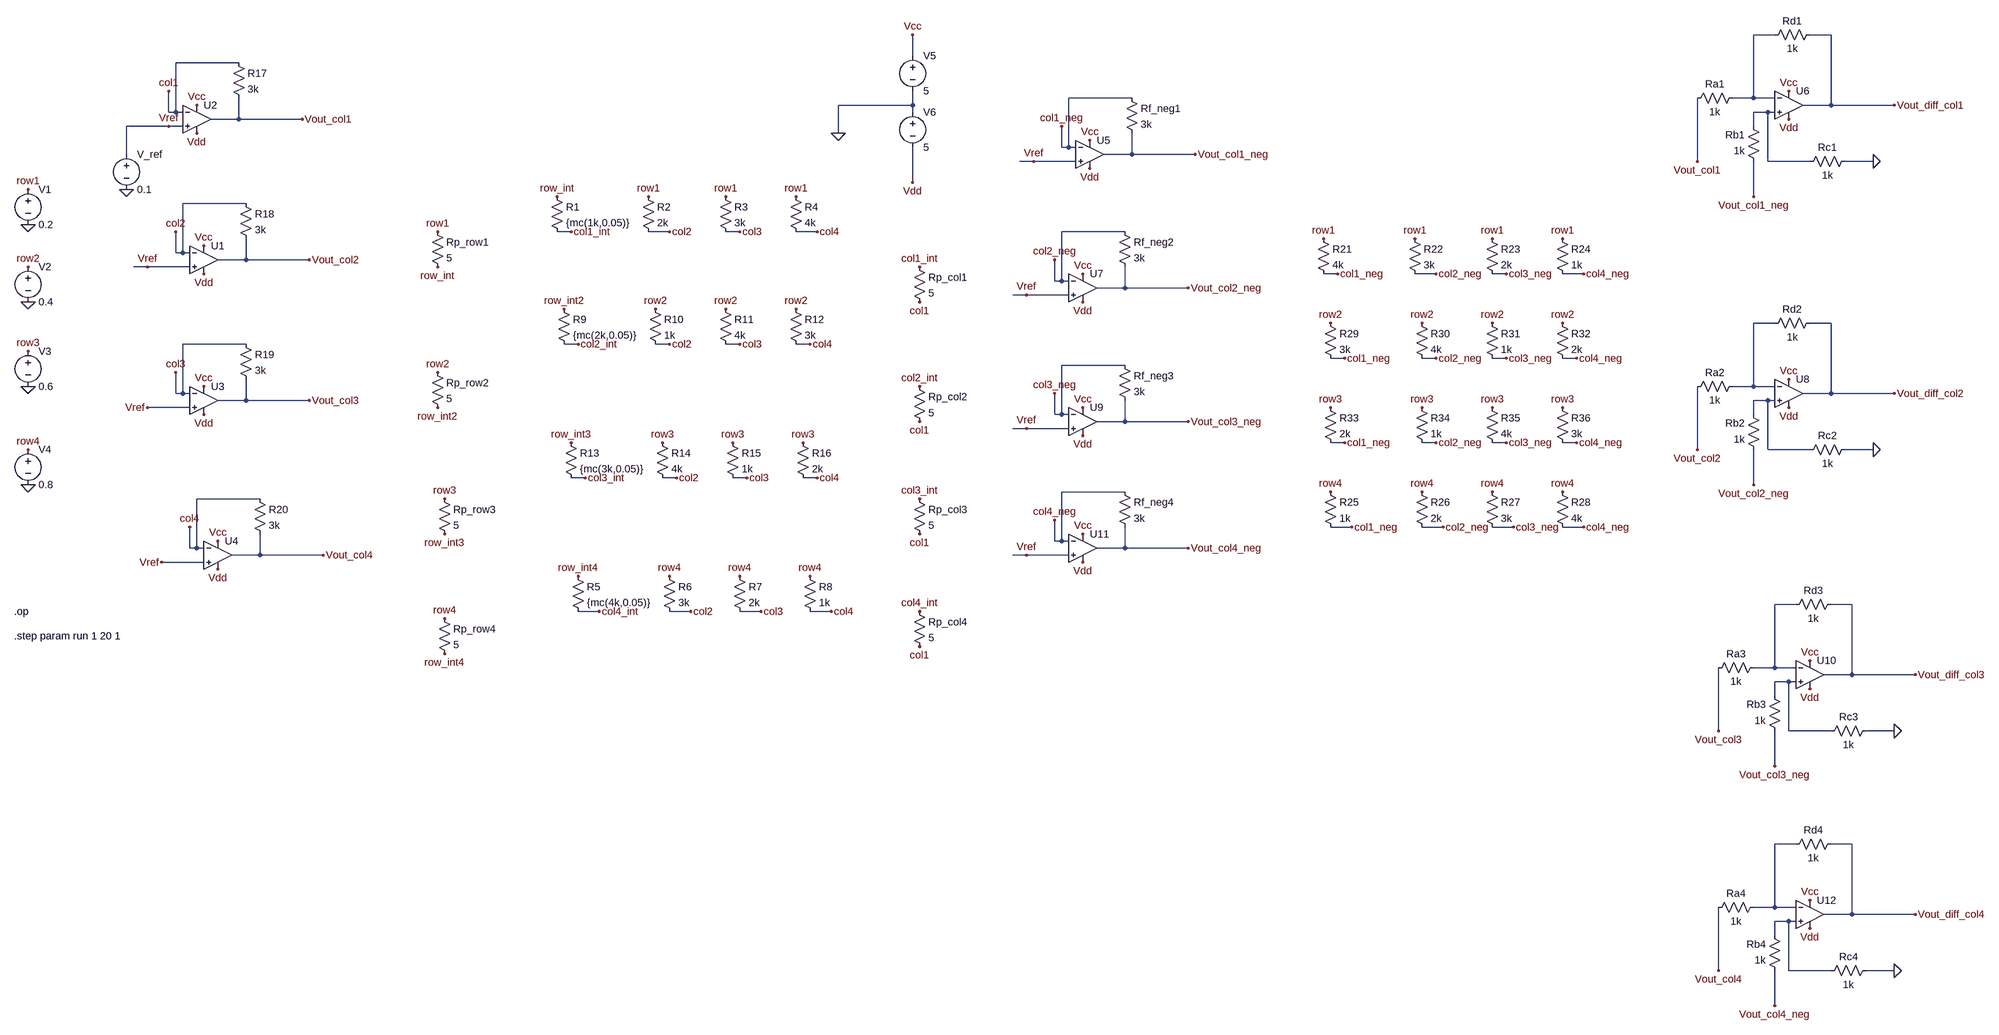
[diagram p0: schematic crossbar_positve array.asc]
crossbar_positve array.asc, the LTspice schematic file:
Version 4.1
SHEET 1 3436 2300
WIRE 2880 -608 2832 -608
WIRE 3008 -608 2960 -608
WIRE 464 -560 464 -608
WIRE -1568 -544 -1712 -544
WIRE 1040 -464 896 -464
WIRE 2832 -464 2832 -608
WIRE 2832 -464 2784 -464
WIRE 2880 -464 2832 -464
WIRE 464 -448 464 -480
WIRE 464 -448 288 -448
WIRE 3008 -448 3008 -608
WIRE 3008 -448 2944 -448
WIRE 3152 -448 3008 -448
WIRE -1728 -432 -1728 -480
WIRE -1712 -432 -1712 -544
WIRE -1712 -432 -1728 -432
WIRE -1696 -432 -1712 -432
WIRE 464 -432 464 -448
WIRE 2864 -432 2832 -432
WIRE 2880 -432 2864 -432
WIRE -1568 -416 -1568 -464
WIRE -1568 -416 -1632 -416
WIRE -1424 -416 -1568 -416
WIRE -1728 -400 -1824 -400
WIRE -1696 -400 -1728 -400
WIRE 2832 -400 2832 -432
WIRE 288 -384 288 -448
WIRE 880 -352 880 -400
WIRE 896 -352 896 -464
WIRE 896 -352 880 -352
WIRE 912 -352 896 -352
WIRE -1824 -336 -1824 -400
WIRE 1040 -336 1040 -384
WIRE 1040 -336 976 -336
WIRE 1184 -336 1040 -336
WIRE 816 -320 784 -320
WIRE 912 -320 816 -320
WIRE 2704 -320 2704 -464
WIRE 2864 -320 2864 -432
WIRE 2960 -320 2864 -320
WIRE 3104 -320 3040 -320
WIRE 464 -272 464 -352
WIRE 2832 -240 2832 -320
WIRE -1552 -224 -1696 -224
WIRE -320 -160 -352 -160
WIRE -96 -160 -144 -160
WIRE 64 -160 32 -160
WIRE 240 -160 192 -160
WIRE 1024 -160 880 -160
WIRE -1712 -112 -1712 -160
WIRE -1696 -112 -1696 -224
WIRE -1696 -112 -1712 -112
WIRE -1680 -112 -1696 -112
WIRE -1552 -96 -1552 -144
WIRE -1552 -96 -1616 -96
WIRE -1408 -96 -1552 -96
WIRE -1776 -80 -1808 -80
WIRE -1680 -80 -1776 -80
WIRE 1680 -64 1648 -64
WIRE 1904 -64 1856 -64
WIRE 2064 -64 2032 -64
WIRE 2240 -64 2192 -64
WIRE 864 -48 864 -96
WIRE 880 -48 880 -160
WIRE 880 -48 864 -48
WIRE 896 -48 880 -48
WIRE 1024 -32 1024 -80
WIRE 1024 -32 960 -32
WIRE 1168 -32 1024 -32
WIRE 800 -16 768 -16
WIRE 896 -16 800 -16
WIRE 2880 48 2832 48
WIRE 3008 48 2960 48
WIRE -1552 96 -1696 96
WIRE -304 96 -336 96
WIRE -96 96 -128 96
WIRE 64 96 32 96
WIRE 224 96 192 96
WIRE 1696 128 1664 128
WIRE 1904 128 1872 128
WIRE 2064 128 2032 128
WIRE 2224 128 2192 128
WIRE 1024 144 880 144
WIRE 2832 192 2832 48
WIRE 2832 192 2784 192
WIRE 2880 192 2832 192
WIRE -1712 208 -1712 160
WIRE -1696 208 -1696 96
WIRE -1696 208 -1712 208
WIRE -1680 208 -1696 208
WIRE 3008 208 3008 48
WIRE 3008 208 2944 208
WIRE 3152 208 3008 208
WIRE -1552 224 -1552 176
WIRE -1552 224 -1616 224
WIRE -1408 224 -1552 224
WIRE 2864 224 2832 224
WIRE 2880 224 2864 224
WIRE -1680 240 -1776 240
WIRE 864 256 864 208
WIRE 880 256 880 144
WIRE 880 256 864 256
WIRE 896 256 880 256
WIRE 2832 256 2832 224
WIRE 1024 272 1024 224
WIRE 1024 272 960 272
WIRE 1168 272 1024 272
WIRE 800 288 768 288
WIRE 896 288 800 288
WIRE 1696 320 1664 320
WIRE 1904 320 1872 320
WIRE 2064 320 2032 320
WIRE 2224 320 2192 320
WIRE 2704 336 2704 192
WIRE 2864 336 2864 224
WIRE 2960 336 2864 336
WIRE 3104 336 3040 336
WIRE -288 400 -320 400
WIRE -80 400 -112 400
WIRE 80 400 48 400
WIRE 240 400 208 400
WIRE 2832 416 2832 336
WIRE 1024 432 880 432
WIRE -1520 448 -1664 448
WIRE 1712 512 1664 512
WIRE 1920 512 1872 512
WIRE 2080 512 2032 512
WIRE 2240 512 2192 512
WIRE 864 544 864 496
WIRE 880 544 880 432
WIRE 880 544 864 544
WIRE 896 544 880 544
WIRE -1680 560 -1680 512
WIRE -1664 560 -1664 448
WIRE -1664 560 -1680 560
WIRE -1648 560 -1664 560
WIRE 1024 560 1024 512
WIRE 1024 560 960 560
WIRE 1168 560 1024 560
WIRE -1520 576 -1520 528
WIRE -1520 576 -1584 576
WIRE -1376 576 -1520 576
WIRE 800 576 768 576
WIRE 896 576 800 576
WIRE -1648 592 -1744 592
WIRE 2928 688 2880 688
WIRE 3056 688 3008 688
WIRE -256 704 -304 704
WIRE -48 704 -96 704
WIRE 112 704 64 704
WIRE 272 704 224 704
WIRE 2880 832 2880 688
WIRE 2880 832 2832 832
WIRE 2928 832 2880 832
WIRE 3056 848 3056 688
WIRE 3056 848 2992 848
WIRE 3200 848 3056 848
WIRE 2912 864 2880 864
WIRE 2928 864 2912 864
WIRE 2880 896 2880 864
WIRE 2752 976 2752 832
WIRE 2912 976 2912 864
WIRE 3008 976 2912 976
WIRE 3152 976 3088 976
WIRE 2880 1056 2880 976
WIRE 2928 1360 2880 1360
WIRE 3056 1360 3008 1360
WIRE 2880 1504 2880 1360
WIRE 2880 1504 2832 1504
WIRE 2928 1504 2880 1504
WIRE 3056 1520 3056 1360
WIRE 3056 1520 2992 1520
WIRE 3200 1520 3056 1520
WIRE 2912 1536 2880 1536
WIRE 2928 1536 2912 1536
WIRE 2880 1568 2880 1536
WIRE 2752 1648 2752 1504
WIRE 2912 1648 2912 1536
WIRE 3008 1648 2912 1648
WIRE 3152 1648 3088 1648
WIRE 2880 1728 2880 1648
FLAG -352 -240 row_int
FLAG -144 -240 row1
FLAG 32 -240 row1
FLAG 192 -240 row1
FLAG -336 16 row_int2
FLAG -128 16 row2
FLAG 32 16 row2
FLAG 192 16 row2
FLAG -320 320 row_int3
FLAG -112 320 row3
FLAG 48 320 row3
FLAG 208 320 row3
FLAG -304 624 row_int4
FLAG -96 624 row4
FLAG 64 624 row4
FLAG 224 624 row4
FLAG -96 -160 col2
FLAG -96 96 col2
FLAG -80 400 col2
FLAG -48 704 col2
FLAG 64 -160 col3
FLAG 64 96 col3
FLAG 80 400 col3
FLAG 112 704 col3
FLAG 240 -160 col4
FLAG 224 96 col4
FLAG 240 400 col4
FLAG 272 704 col4
FLAG -2048 192 0
FLAG -2048 416 0
FLAG -2048 0 0
FLAG -2048 -176 0
FLAG -2048 -256 row1
FLAG -2048 -80 row2
FLAG -2048 112 row3
FLAG -2048 336 row4
FLAG -1824 -256 0
FLAG -1728 -480 col1
FLAG -1664 -448 Vcc
FLAG 464 -608 Vcc
FLAG -1664 -384 Vdd
FLAG 464 -272 Vdd
FLAG 288 -384 0
FLAG -1424 -416 Vout_col1
FLAG -1712 -160 col2
FLAG -1648 -128 Vcc
FLAG -1648 -64 Vdd
FLAG -1408 -96 Vout_col2
FLAG -1712 160 col3
FLAG -1648 192 Vcc
FLAG -1648 256 Vdd
FLAG -1408 224 Vout_col3
FLAG -1680 512 col4
FLAG -1616 544 Vcc
FLAG -1616 608 Vdd
FLAG -1376 576 Vout_col4
FLAG -1776 -80 Vref
FLAG -1776 240 Vref
FLAG -1744 592 Vref
FLAG -1728 -400 Vref
FLAG 1648 -144 row1
FLAG 1856 -144 row1
FLAG 2032 -144 row1
FLAG 2192 -144 row1
FLAG 1664 48 row2
FLAG 1872 48 row2
FLAG 2032 48 row2
FLAG 2192 48 row2
FLAG 1664 240 row3
FLAG 1872 240 row3
FLAG 2032 240 row3
FLAG 2192 240 row3
FLAG 1664 432 row4
FLAG 1872 432 row4
FLAG 2032 432 row4
FLAG 2192 432 row4
FLAG 1712 512 col1_neg
FLAG 1680 -64 col1_neg
FLAG 1696 128 col1_neg
FLAG 1696 320 col1_neg
FLAG 1904 -64 col2_neg
FLAG 1904 128 col2_neg
FLAG 1904 320 col2_neg
FLAG 1920 512 col2_neg
FLAG 2064 -64 col3_neg
FLAG 2064 128 col3_neg
FLAG 2064 320 col3_neg
FLAG 2080 512 col3_neg
FLAG 2240 -64 col4_neg
FLAG 2224 128 col4_neg
FLAG 2224 320 col4_neg
FLAG 2240 512 col4_neg
FLAG 880 -400 col1_neg
FLAG 944 -368 Vcc
FLAG 944 -304 Vdd
FLAG 1184 -336 Vout_col1_neg
FLAG 816 -320 Vref
FLAG 2912 -480 Vcc
FLAG 2912 -416 Vdd
FLAG 3152 -448 Vout_diff_col1
FLAG 2704 -320 Vout_col1
FLAG 2832 -240 Vout_col1_neg
FLAG 3104 -320 0
FLAG 864 -96 col2_neg
FLAG 928 -64 Vcc
FLAG 928 0 Vdd
FLAG 1168 -32 Vout_col2_neg
FLAG 800 -16 Vref
FLAG 2912 176 Vcc
FLAG 2912 240 Vdd
FLAG 3152 208 Vout_diff_col2
FLAG 2704 336 Vout_col2
FLAG 2832 416 Vout_col2_neg
FLAG 3104 336 0
FLAG 864 208 col3_neg
FLAG 928 240 Vcc
FLAG 928 304 Vdd
FLAG 1168 272 Vout_col3_neg
FLAG 800 288 Vref
FLAG 2960 816 Vcc
FLAG 2960 880 Vdd
FLAG 3200 848 Vout_diff_col3
FLAG 2752 976 Vout_col3
FLAG 2880 1056 Vout_col3_neg
FLAG 3152 976 0
FLAG 864 496 col4_neg
FLAG 928 528 Vcc
FLAG 928 592 Vdd
FLAG 1168 560 Vout_col4_neg
FLAG 800 576 Vref
FLAG 2960 1488 Vcc
FLAG 2960 1552 Vdd
FLAG 3200 1520 Vout_diff_col4
FLAG 2752 1648 Vout_col4
FLAG 2880 1728 Vout_col4_neg
FLAG 3152 1648 0
FLAG -784 -160 row1
FLAG -784 -80 row_int
FLAG -784 160 row2
FLAG -784 240 row_int2
FLAG -768 448 row3
FLAG -768 528 row_int3
FLAG -768 720 row4
FLAG -768 800 row_int4
FLAG 480 -80 col1_int
FLAG 480 0 col1
FLAG -320 -160 col1_int
FLAG -304 96 col2_int
FLAG -288 400 col3_int
FLAG -256 704 col4_int
FLAG 480 192 col2_int
FLAG 480 272 col1
FLAG 480 448 col3_int
FLAG 480 528 col1
FLAG 480 704 col4_int
FLAG 480 784 col1
SYMBOL res -368 -256 R0
SYMATTR InstName R1
SYMATTR Value {mc(1k,0.05)}
SYMBOL res -160 -256 R0
SYMATTR InstName R2
SYMATTR Value 2k
SYMBOL res 16 -256 R0
SYMATTR InstName R3
SYMATTR Value 3k
SYMBOL res 176 -256 R0
SYMATTR InstName R4
SYMATTR Value 4k
SYMBOL res -320 608 R0
SYMATTR InstName R5
SYMATTR Value {mc(4k,0.05)}
SYMBOL res -112 608 R0
SYMATTR InstName R6
SYMATTR Value 3k
SYMBOL res 48 608 R0
SYMATTR InstName R7
SYMATTR Value 2k
SYMBOL res 208 608 R0
SYMATTR InstName R8
SYMATTR Value 1k
SYMBOL res -352 0 R0
SYMATTR InstName R9
SYMATTR Value {mc(2k,0.05)}
SYMBOL res -144 0 R0
SYMATTR InstName R10
SYMATTR Value 1k
SYMBOL res 16 0 R0
SYMATTR InstName R11
SYMATTR Value 4k
SYMBOL res 176 0 R0
SYMATTR InstName R12
SYMATTR Value 3k
SYMBOL res -336 304 R0
SYMATTR InstName R13
SYMATTR Value {mc(3k,0.05)}
SYMBOL res -128 304 R0
SYMATTR InstName R14
SYMATTR Value 4k
SYMBOL res 32 304 R0
SYMATTR InstName R15
SYMATTR Value 1k
SYMBOL res 192 304 R0
SYMATTR InstName R16
SYMATTR Value 2k
SYMBOL voltage -2048 -272 R0
SYMATTR InstName V1
SYMATTR Value 0.2
SYMBOL voltage -2048 -96 R0
SYMATTR InstName V2
SYMATTR Value 0.4
SYMBOL voltage -2048 96 R0
SYMATTR InstName V3
SYMATTR Value 0.6
SYMBOL voltage -2048 320 R0
SYMATTR InstName V4
SYMATTR Value 0.8
SYMBOL voltage -1824 -352 R0
SYMATTR InstName V_ref
SYMATTR Value 0.1
SYMBOL res -1584 -560 R0
SYMATTR InstName R17
SYMATTR Value 3k
SYMBOL voltage 464 -576 R0
WINDOW 123 0 0 Left 0
WINDOW 39 0 0 Left 0
SYMATTR InstName V5
SYMATTR Value 5
SYMBOL voltage 464 -448 R0
SYMATTR InstName V6
SYMATTR Value 5
SYMBOL OpAmps\\UniversalOpAmp2 -1664 -416 R0
SYMATTR InstName U2
SYMBOL res -1568 -240 R0
SYMATTR InstName R18
SYMATTR Value 3k
SYMBOL OpAmps\\UniversalOpAmp2 -1648 -96 R0
SYMATTR InstName U1
SYMBOL res -1568 80 R0
SYMATTR InstName R19
SYMATTR Value 3k
SYMBOL OpAmps\\UniversalOpAmp2 -1648 224 R0
SYMATTR InstName U3
SYMBOL res -1536 432 R0
SYMATTR InstName R20
SYMATTR Value 3k
SYMBOL OpAmps\\UniversalOpAmp2 -1616 576 R0
SYMATTR InstName U4
SYMBOL res 1632 -160 R0
SYMATTR InstName R21
SYMATTR Value 4k
SYMBOL res 1840 -160 R0
SYMATTR InstName R22
SYMATTR Value 3k
SYMBOL res 2016 -160 R0
SYMATTR InstName R23
SYMATTR Value 2k
SYMBOL res 2176 -160 R0
SYMATTR InstName R24
SYMATTR Value 1k
SYMBOL res 1648 416 R0
SYMATTR InstName R25
SYMATTR Value 1k
SYMBOL res 1856 416 R0
SYMATTR InstName R26
SYMATTR Value 2k
SYMBOL res 2016 416 R0
SYMATTR InstName R27
SYMATTR Value 3k
SYMBOL res 2176 416 R0
SYMATTR InstName R28
SYMATTR Value 4k
SYMBOL res 1648 32 R0
SYMATTR InstName R29
SYMATTR Value 3k
SYMBOL res 1856 32 R0
SYMATTR InstName R30
SYMATTR Value 4k
SYMBOL res 2016 32 R0
SYMATTR InstName R31
SYMATTR Value 1k
SYMBOL res 2176 32 R0
SYMATTR InstName R32
SYMATTR Value 2k
SYMBOL res 1648 224 R0
SYMATTR InstName R33
SYMATTR Value 2k
SYMBOL res 1856 224 R0
SYMATTR InstName R34
SYMATTR Value 1k
SYMBOL res 2016 224 R0
SYMATTR InstName R35
SYMATTR Value 4k
SYMBOL res 2176 224 R0
SYMATTR InstName R36
SYMATTR Value 3k
SYMBOL res 1024 -480 R0
SYMATTR InstName Rf_neg1
SYMATTR Value 3k
SYMBOL OpAmps\\UniversalOpAmp2 944 -336 R0
SYMATTR InstName U5
SYMBOL OpAmps\\UniversalOpAmp2 2912 -448 R0
SYMATTR InstName U6
SYMBOL res 2800 -480 R90
WINDOW 0 0 56 VBottom 2
WINDOW 3 32 56 VTop 2
SYMATTR InstName Ra1
SYMATTR Value 1k
SYMBOL res 2976 -624 R90
WINDOW 0 0 56 VBottom 2
WINDOW 3 32 56 VTop 2
SYMATTR InstName Rd1
SYMATTR Value 1k
SYMBOL res 2848 -304 R180
WINDOW 0 36 76 Left 2
WINDOW 3 36 40 Left 2
SYMATTR InstName Rb1
SYMATTR Value 1k
SYMBOL res 2944 -304 R270
WINDOW 0 32 56 VTop 2
WINDOW 3 0 56 VBottom 2
SYMATTR InstName Rc1
SYMATTR Value 1k
SYMBOL res 1008 -176 R0
SYMATTR InstName Rf_neg2
SYMATTR Value 3k
SYMBOL OpAmps\\UniversalOpAmp2 928 -32 R0
SYMATTR InstName U7
SYMBOL OpAmps\\UniversalOpAmp2 2912 208 R0
SYMATTR InstName U8
SYMBOL res 2800 176 R90
WINDOW 0 0 56 VBottom 2
WINDOW 3 32 56 VTop 2
SYMATTR InstName Ra2
SYMATTR Value 1k
SYMBOL res 2976 32 R90
WINDOW 0 0 56 VBottom 2
WINDOW 3 32 56 VTop 2
SYMATTR InstName Rd2
SYMATTR Value 1k
SYMBOL res 2848 352 R180
WINDOW 0 36 76 Left 2
WINDOW 3 36 40 Left 2
SYMATTR InstName Rb2
SYMATTR Value 1k
SYMBOL res 2944 352 R270
WINDOW 0 32 56 VTop 2
WINDOW 3 0 56 VBottom 2
SYMATTR InstName Rc2
SYMATTR Value 1k
SYMBOL res 1008 128 R0
SYMATTR InstName Rf_neg3
SYMATTR Value 3k
SYMBOL OpAmps\\UniversalOpAmp2 928 272 R0
SYMATTR InstName U9
SYMBOL OpAmps\\UniversalOpAmp2 2960 848 R0
SYMATTR InstName U10
SYMBOL res 2848 816 R90
WINDOW 0 0 56 VBottom 2
WINDOW 3 32 56 VTop 2
SYMATTR InstName Ra3
SYMATTR Value 1k
SYMBOL res 3024 672 R90
WINDOW 0 0 56 VBottom 2
WINDOW 3 32 56 VTop 2
SYMATTR InstName Rd3
SYMATTR Value 1k
SYMBOL res 2896 992 R180
WINDOW 0 36 76 Left 2
WINDOW 3 36 40 Left 2
SYMATTR InstName Rb3
SYMATTR Value 1k
SYMBOL res 2992 992 R270
WINDOW 0 32 56 VTop 2
WINDOW 3 0 56 VBottom 2
SYMATTR InstName Rc3
SYMATTR Value 1k
SYMBOL res 1008 416 R0
SYMATTR InstName Rf_neg4
SYMATTR Value 3k
SYMBOL OpAmps\\UniversalOpAmp2 928 560 R0
SYMATTR InstName U11
SYMBOL OpAmps\\UniversalOpAmp2 2960 1520 R0
SYMATTR InstName U12
SYMBOL res 2848 1488 R90
WINDOW 0 0 56 VBottom 2
WINDOW 3 32 56 VTop 2
SYMATTR InstName Ra4
SYMATTR Value 1k
SYMBOL res 3024 1344 R90
WINDOW 0 0 56 VBottom 2
WINDOW 3 32 56 VTop 2
SYMATTR InstName Rd4
SYMATTR Value 1k
SYMBOL res 2896 1664 R180
WINDOW 0 36 76 Left 2
WINDOW 3 36 40 Left 2
SYMATTR InstName Rb4
SYMATTR Value 1k
SYMBOL res 2992 1664 R270
WINDOW 0 32 56 VTop 2
WINDOW 3 0 56 VBottom 2
SYMATTR InstName Rc4
SYMATTR Value 1k
SYMBOL res -800 -176 R0
SYMATTR InstName Rp_row1
SYMATTR Value 5
SYMBOL res -800 144 R0
SYMATTR InstName Rp_row2
SYMATTR Value 5
SYMBOL res -784 432 R0
SYMATTR InstName Rp_row3
SYMATTR Value 5
SYMBOL res -784 704 R0
SYMATTR InstName Rp_row4
SYMATTR Value 5
SYMBOL res 464 -96 R0
SYMATTR InstName Rp_col1
SYMATTR Value 5
SYMBOL res 464 176 R0
SYMATTR InstName Rp_col2
SYMATTR Value 5
SYMBOL res 464 432 R0
SYMATTR InstName Rp_col3
SYMATTR Value 5
SYMBOL res 464 688 R0
SYMATTR InstName Rp_col4
SYMATTR Value 5
TEXT -2080 704 Left 2 !.op
TEXT -2080 760 Left 2 !.step param run 1 20 1

The netlist it stands for:
* crossbar_positve array.asc
R1 row_int col1_int {mc(1k,0.05)}
R2 row1 col2 2k
R3 row1 col3 3k
R4 row1 col4 4k
R5 row_int4 col4_int {mc(4k,0.05)}
R6 row4 col2 3k
R7 row4 col3 2k
R8 row4 col4 1k
R9 row_int2 col2_int {mc(2k,0.05)}
R10 row2 col2 1k
R11 row2 col3 4k
R12 row2 col4 3k
R13 row_int3 col3_int {mc(3k,0.05)}
R14 row3 col2 4k
R15 row3 col3 1k
R16 row3 col4 2k
V1 row1 0 0.2
V2 row2 0 0.4
V3 row3 0 0.6
V4 row4 0 0.8
V_ref Vref 0 0.1
R17 col1 Vout_col1 3k
V5 Vcc 0 5
V6 0 Vdd 5
X§U2 Vref col1 Vcc Vdd Vout_col1 level2 Avol=1Meg GBW=10Meg Slew=10Meg Ilimit=25m Rail=0 Vos=0 En=0 Enk=0 In=0 Ink=0 Rin=500Meg  ; pins In+ In- V+ V- OUT
R18 col2 Vout_col2 3k
X§U1 Vref col2 Vcc Vdd Vout_col2 level2 Avol=1Meg GBW=10Meg Slew=10Meg Ilimit=25m Rail=0 Vos=0 En=0 Enk=0 In=0 Ink=0 Rin=500Meg  ; pins In+ In- V+ V- OUT
R19 col3 Vout_col3 3k
X§U3 Vref col3 Vcc Vdd Vout_col3 level2 Avol=1Meg GBW=10Meg Slew=10Meg Ilimit=25m Rail=0 Vos=0 En=0 Enk=0 In=0 Ink=0 Rin=500Meg  ; pins In+ In- V+ V- OUT
R20 col4 Vout_col4 3k
X§U4 Vref col4 Vcc Vdd Vout_col4 level2 Avol=1Meg GBW=10Meg Slew=10Meg Ilimit=25m Rail=0 Vos=0 En=0 Enk=0 In=0 Ink=0 Rin=500Meg  ; pins In+ In- V+ V- OUT
R21 row1 col1_neg 4k
R22 row1 col2_neg 3k
R23 row1 col3_neg 2k
R24 row1 col4_neg 1k
R25 row4 col1_neg 1k
R26 row4 col2_neg 2k
R27 row4 col3_neg 3k
R28 row4 col4_neg 4k
R29 row2 col1_neg 3k
R30 row2 col2_neg 4k
R31 row2 col3_neg 1k
R32 row2 col4_neg 2k
R33 row3 col1_neg 2k
R34 row3 col2_neg 1k
R35 row3 col3_neg 4k
R36 row3 col4_neg 3k
Rf_neg1 col1_neg Vout_col1_neg 3k
X§U5 Vref col1_neg Vcc Vdd Vout_col1_neg level2 Avol=1Meg GBW=10Meg Slew=10Meg Ilimit=25m Rail=0 Vos=0 En=0 Enk=0 In=0 Ink=0 Rin=500Meg  ; pins In+ In- V+ V- OUT
X§U6 N002 N001 Vcc Vdd Vout_diff_col1 level2 Avol=1Meg GBW=10Meg Slew=10Meg Ilimit=25m Rail=0 Vos=0 En=0 Enk=0 In=0 Ink=0 Rin=500Meg  ; pins In+ In- V+ V- OUT
Ra1 N001 Vout_col1 1k
Rd1 Vout_diff_col1 N001 1k
Rb1 Vout_col1_neg N002 1k
Rc1 N002 0 1k
Rf_neg2 col2_neg Vout_col2_neg 3k
X§U7 Vref col2_neg Vcc Vdd Vout_col2_neg level2 Avol=1Meg GBW=10Meg Slew=10Meg Ilimit=25m Rail=0 Vos=0 En=0 Enk=0 In=0 Ink=0 Rin=500Meg  ; pins In+ In- V+ V- OUT
X§U8 N004 N003 Vcc Vdd Vout_diff_col2 level2 Avol=1Meg GBW=10Meg Slew=10Meg Ilimit=25m Rail=0 Vos=0 En=0 Enk=0 In=0 Ink=0 Rin=500Meg  ; pins In+ In- V+ V- OUT
Ra2 N003 Vout_col2 1k
Rd2 Vout_diff_col2 N003 1k
Rb2 Vout_col2_neg N004 1k
Rc2 N004 0 1k
Rf_neg3 col3_neg Vout_col3_neg 3k
X§U9 Vref col3_neg Vcc Vdd Vout_col3_neg level2 Avol=1Meg GBW=10Meg Slew=10Meg Ilimit=25m Rail=0 Vos=0 En=0 Enk=0 In=0 Ink=0 Rin=500Meg  ; pins In+ In- V+ V- OUT
X§U10 N006 N005 Vcc Vdd Vout_diff_col3 level2 Avol=1Meg GBW=10Meg Slew=10Meg Ilimit=25m Rail=0 Vos=0 En=0 Enk=0 In=0 Ink=0 Rin=500Meg  ; pins In+ In- V+ V- OUT
Ra3 N005 Vout_col3 1k
Rd3 Vout_diff_col3 N005 1k
Rb3 Vout_col3_neg N006 1k
Rc3 N006 0 1k
Rf_neg4 col4_neg Vout_col4_neg 3k
X§U11 Vref col4_neg Vcc Vdd Vout_col4_neg level2 Avol=1Meg GBW=10Meg Slew=10Meg Ilimit=25m Rail=0 Vos=0 En=0 Enk=0 In=0 Ink=0 Rin=500Meg  ; pins In+ In- V+ V- OUT
X§U12 N008 N007 Vcc Vdd Vout_diff_col4 level2 Avol=1Meg GBW=10Meg Slew=10Meg Ilimit=25m Rail=0 Vos=0 En=0 Enk=0 In=0 Ink=0 Rin=500Meg  ; pins In+ In- V+ V- OUT
Ra4 N007 Vout_col4 1k
Rd4 Vout_diff_col4 N007 1k
Rb4 Vout_col4_neg N008 1k
Rc4 N008 0 1k
Rp_row1 row1 row_int 5
Rp_row2 row2 row_int2 5
Rp_row3 row3 row_int3 5
Rp_row4 row4 row_int4 5
Rp_col1 col1_int col1 5
Rp_col2 col2_int col1 5
Rp_col3 col3_int col1 5
Rp_col4 col4_int col1 5
.op
.step param run 1 20 1
.lib UniversalOpAmp2.lib
.backanno
.end